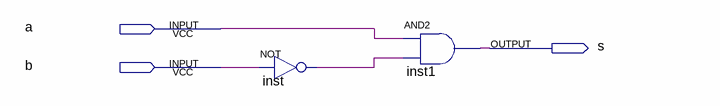
[diagram p0: schematic sheet]
// Quartus schematic maiorQueBit-Bit-OK.bdf as structural Verilog: 2 symbols, 3 pins
module \maiorQueBit-Bit-OK  (
  input  a,
  input  b,
  output s
);

  wire inst_out;

  not inst (inst_out, b);
  and inst1 (s, a, inst_out);
endmodule
